# Altium schematic sheet RK3562-VCCIO2-VCCIO3.SchDoc
size 420 x 297 mm; SheetNumber: 8; SheetTotal: 32
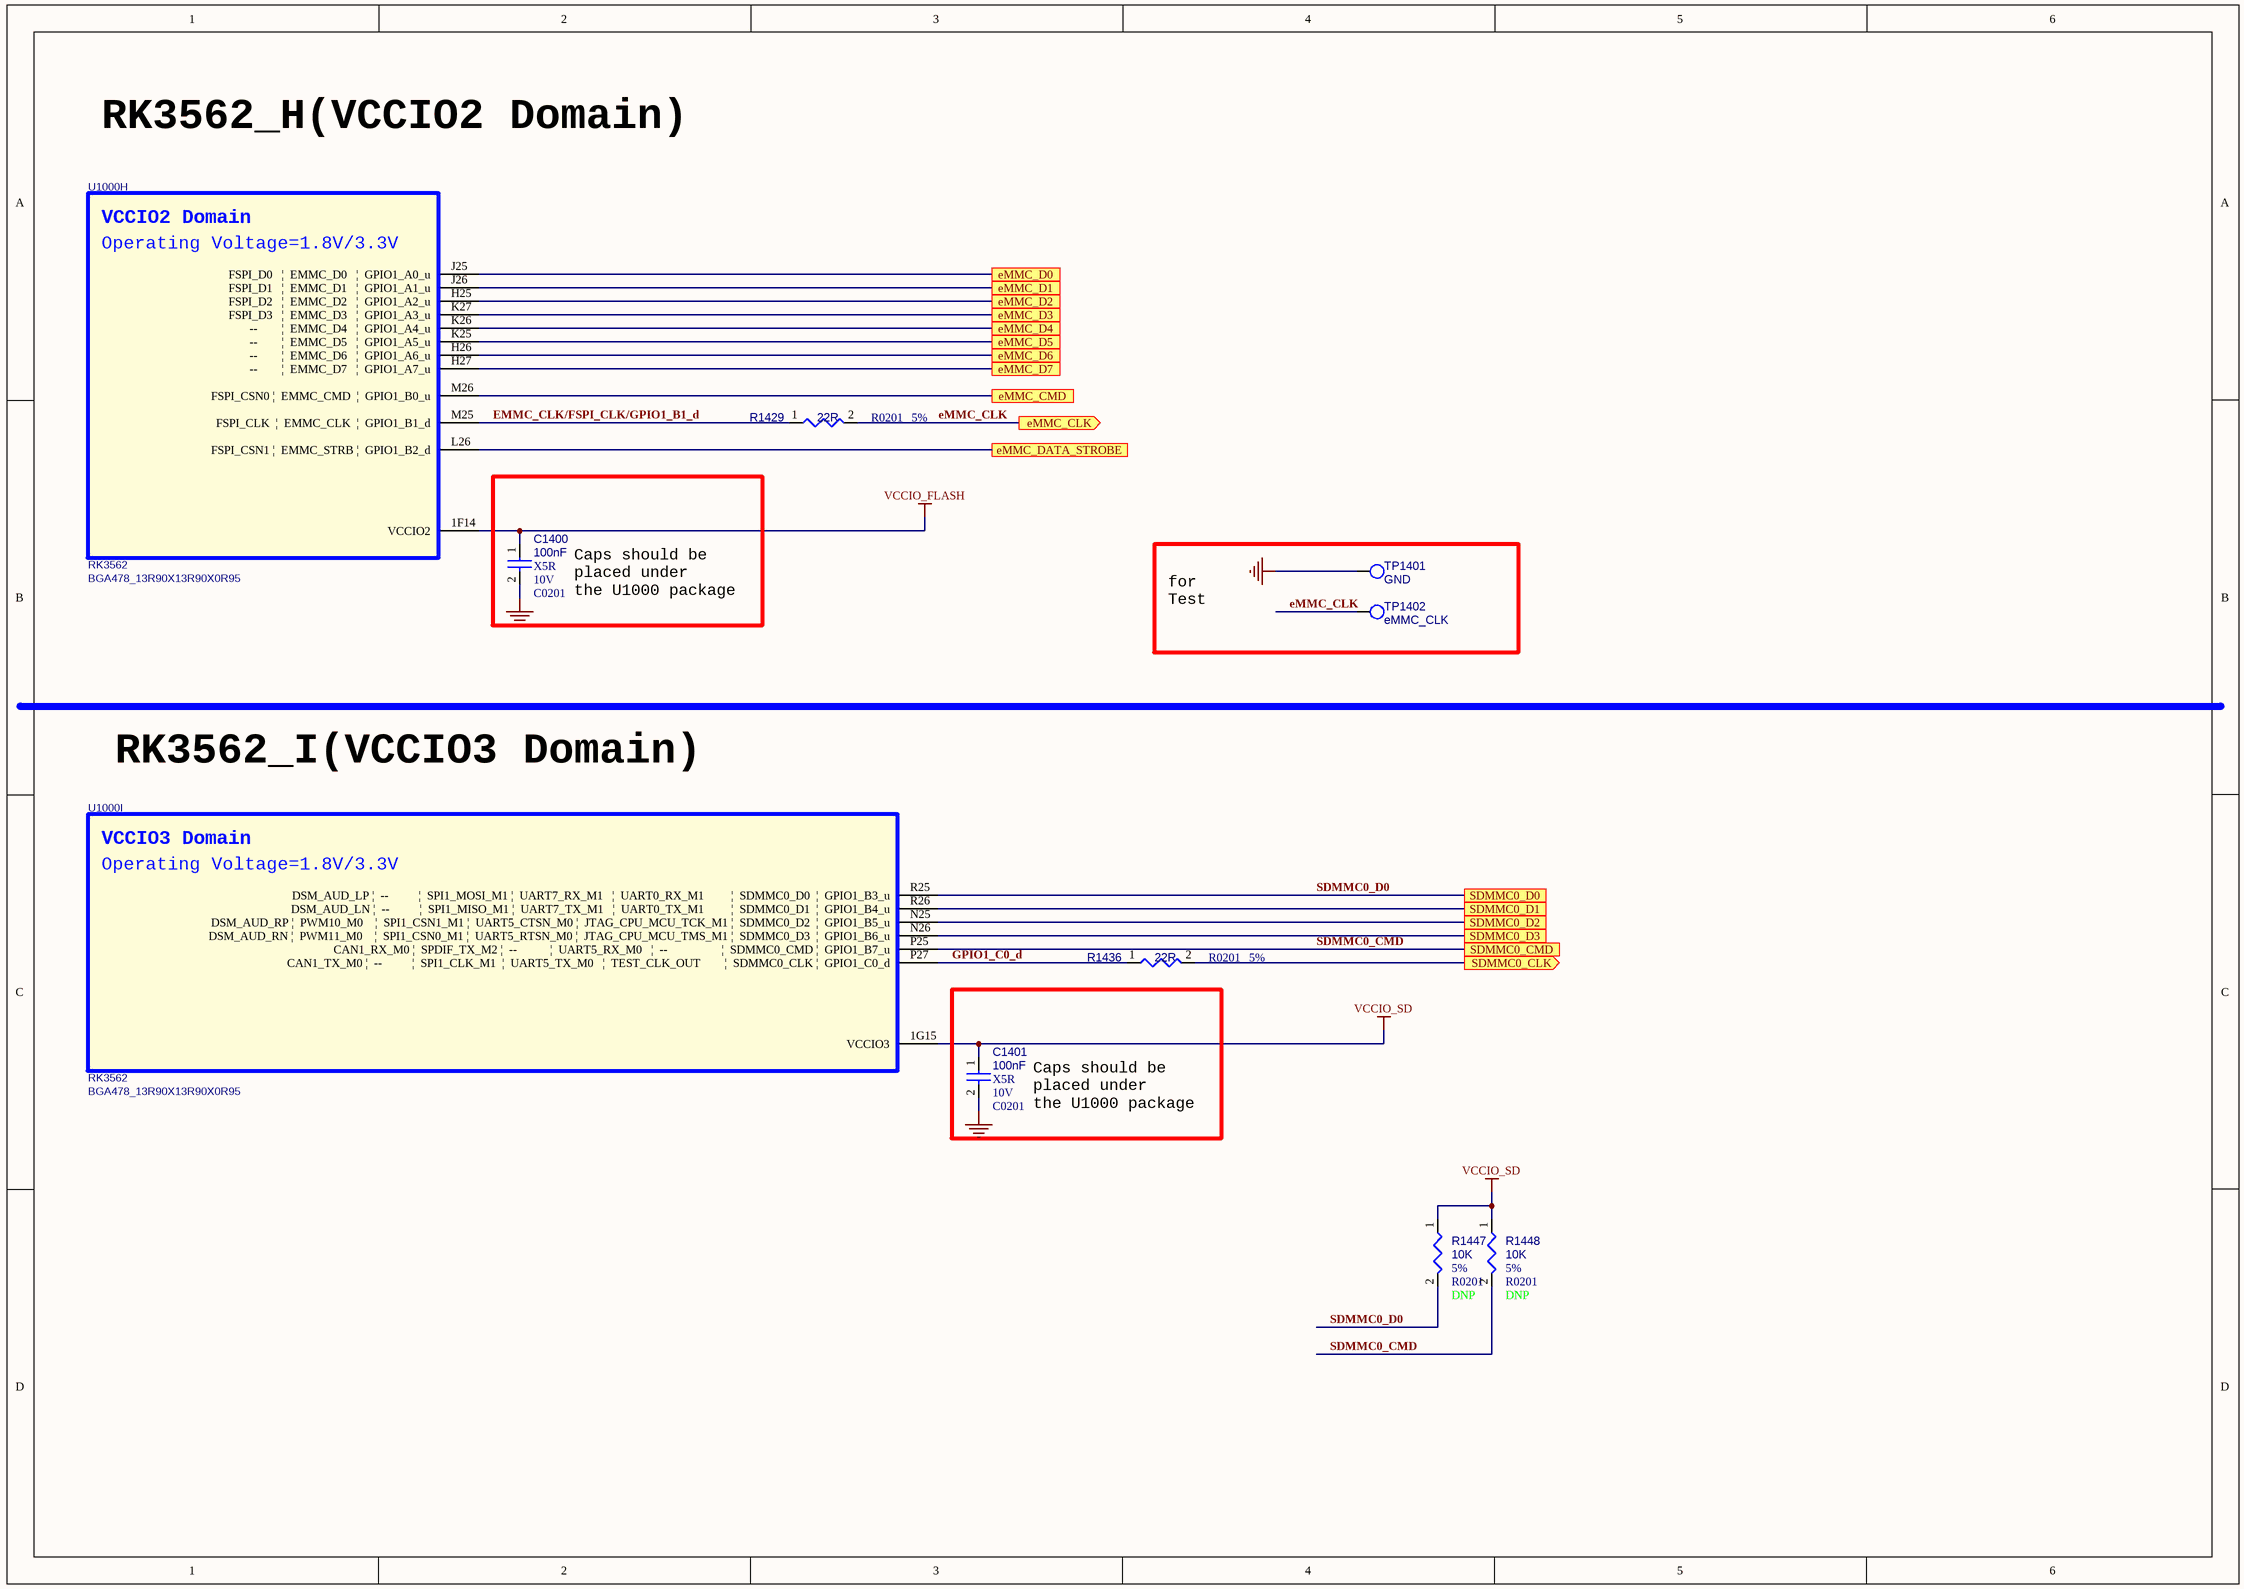
[diagram p0: RK3562-VCCIO2-VCCIO3.SchDoc]

## Parts
C1400  100nF  Dielectric: X5R  Voltage: 10V  [C0201]
C1401  100nF  Dielectric: X5R  Voltage: 10V  [C0201]
R1429  22R  Tolerance: 5%  [R0201]
R1436  22R  Tolerance: 5%  [R0201]
R1447  10K  Tolerance: 5%  option: DNP  [R0201]
R1448  10K  Tolerance: 5%  option: DNP  [R0201]
TP1401  GND  [TP_0R70]
TP1402  eMMC_CLK  [TP_0R70]
U1000  RK3562  [BGA478_13R90X13R90X0R95]  (parts H,I of 16)

## Ports
eMMC_CLK (out, see CONTROLLER-RK3562[4A], eMMC[2A]), eMMC_CMD (see CONTROLLER-RK3562[4A], eMMC[2A]), eMMC_D0 (see CONTROLLER-RK3562[4A], eMMC[2A]), eMMC_D1 (see CONTROLLER-RK3562[4A], eMMC[2A]), eMMC_D2 (see CONTROLLER-RK3562[4A], eMMC[2A]), eMMC_D3 (see CONTROLLER-RK3562[4A], eMMC[2A]), eMMC_D4 (see CONTROLLER-RK3562[4A], eMMC[2A]), eMMC_D5 (see CONTROLLER-RK3562[4A], eMMC[2A]), eMMC_D6 (see CONTROLLER-RK3562[4A], eMMC[2A]), eMMC_D7 (see CONTROLLER-RK3562[4A], eMMC[2A]), eMMC_DATA_STROBE (see CONTROLLER-RK3562[4A], eMMC[1B]), SDMMC0_CLK (out, see CONTROLLER-RK3562[4B], SD_TF-CARD[1A]), SDMMC0_CMD (see CONTROLLER-RK3562[4B], SD_TF-CARD[1A]), SDMMC0_D0 (see CONTROLLER-RK3562[4B], SD_TF-CARD[1A]), SDMMC0_D1 (see CONTROLLER-RK3562[4B], SD_TF-CARD[1A]), SDMMC0_D2 (see CONTROLLER-RK3562[4B], SD_TF-CARD[1A]), SDMMC0_D3 (see CONTROLLER-RK3562[4B], SD_TF-CARD[1A])

## Nets
GND: C1400.2 C1401.2 TP1401.1
VCCIO_FLASH: C1400.1 U1000.1F14(VCCIO2)
VCCIO_SD: C1401.1 R1447.1 R1448.1 U1000.1G15(VCCIO3)
eMMC_CLK: R1429.2 TP1402.1 ; port eMMC_CLK
EMMC_CLK/FSPI_CLK/GPIO1_B1_d: R1429.1 U1000.M25(FSPI_CLK__|__EMMC_CLK__|__GPIO1_B1_d)
eMMC_CMD: U1000.M26(FSPI_CSN0_|__EMMC_CMD__|__GPIO1_B0_u) ; port eMMC_CMD
eMMC_D0: U1000.J25(FSPI_D0___|__EMMC_D0___|__GPIO1_A0_u) ; port eMMC_D0
eMMC_D1: U1000.J26(FSPI_D1___|__EMMC_D1___|__GPIO1_A1_u) ; port eMMC_D1
eMMC_D2: U1000.H25(FSPI_D2___|__EMMC_D2___|__GPIO1_A2_u) ; port eMMC_D2
eMMC_D3: U1000.K27(FSPI_D3___|__EMMC_D3___|__GPIO1_A3_u) ; port eMMC_D3
eMMC_D4: U1000.K26(--________|__EMMC_D4___|__GPIO1_A4_u) ; port eMMC_D4
eMMC_D5: U1000.K25(--________|__EMMC_D5___|__GPIO1_A5_u) ; port eMMC_D5
eMMC_D6: U1000.H26(--________|__EMMC_D6___|__GPIO1_A6_u) ; port eMMC_D6
eMMC_D7: U1000.H27(--________|__EMMC_D7___|__GPIO1_A7_u) ; port eMMC_D7
eMMC_DATA_STROBE: U1000.L26(FSPI_CSN1_|__EMMC_STRB_|__GPIO1_B2_d) ; port eMMC_DATA_STROBE
GPIO1_C0_d: R1436.1 U1000.P27(CAN1_TX_M0_|__--__________|__SPI1_CLK_M1__|__UART5_TX_M0___|__TEST_CLK_OUT________|__SDMMC0_CLK_|__GPIO1_C0_d)
SDMMC0_CLK: R1436.2 ; port SDMMC0_CLK
SDMMC0_CMD: R1448.2 U1000.P25(CAN1_RX_M0_|__SPDIF_TX_M2_|__--___________|__UART5_RX_M0___|__--__________________|__SDMMC0_CMD_|__GPIO1_B7_u) ; port SDMMC0_CMD
SDMMC0_D0: R1447.2 U1000.R25(DSM_AUD_LP_|__--__________|__SPI1_MOSI_M1_|__UART7_RX_M1___|__UART0_RX_M1_________|__SDMMC0_D0__|__GPIO1_B3_u) ; port SDMMC0_D0
SDMMC0_D1: U1000.R26(DSM_AUD_LN_|__--__________|__SPI1_MISO_M1_|__UART7_TX_M1___|__UART0_TX_M1_________|__SDMMC0_D1__|__GPIO1_B4_u) ; port SDMMC0_D1
SDMMC0_D2: U1000.N25(DSM_AUD_RP_|__PWM10_M0____|__SPI1_CSN1_M1_|__UART5_CTSN_M0_|__JTAG_CPU_MCU_TCK_M1_|__SDMMC0_D2__|__GPIO1_B5_u) ; port SDMMC0_D2
SDMMC0_D3: U1000.N26(DSM_AUD_RN_|__PWM11_M0____|__SPI1_CSN0_M1_|__UART5_RTSN_M0_|__JTAG_CPU_MCU_TMS_M1_|__SDMMC0_D3__|__GPIO1_B6_u) ; port SDMMC0_D3

## Notes on the sheet
- RK3562_H(VCCIO2 Domain)
- Caps should be
  placed under
  the U1000 package
- for
  Test
- RK3562_I(VCCIO3 Domain)
- (in symbol SOC_RK3562, part H) VCCIO2 Domain; Operating Voltage=1.8V/3.3V
- (in symbol SOC_RK3562, part I) VCCIO3 Domain; Operating Voltage=1.8V/3.3V

## Library data of the parts
C1400 = CAP NP: cap,100.00nF,+/-10%,10V,X5R,C0201; Part Reference: C1400; Manufacturer PN: C0603X5R1A104K030BC; Manufacturer: TDK; Tolerance: 10%; Priority: A; PCB Footprint: C0201; Value: 100nF; Created by: JJJ; Part Type: C0201; RK PN: C0603X5R1A104K030BC; ClassName: RK
C1401 = CAP NP: cap,100.00nF,+/-10%,10V,X5R,C0201; Part Reference: C1401; Manufacturer: TDK; RK PN: C0603X5R1A104K030BC; Priority: A; Tolerance: 10%; PCB Footprint: C0201; Value: 100nF; Part Type: C0201; Manufacturer PN: C0603X5R1A104K030BC; Created by: JJJ; ClassName: RK
R1429 = RESISTOR: 通用厚膜电阻,22R,+/-5%,R0201,1/20W.; Part Reference: R1429; Manufacturer PN: RC0201JR-0722RL; Manufacturer: YAGEO; Wattage: 1/20W; Priority: A; RK PN: 901000523; PCB Footprint: R0201; Value: 22R; Created by: YTL; Part Type: 通用厚膜电阻; ClassName: RK
R1436 = RESISTOR: 通用厚膜电阻,22R,+/-5%,R0201,1/20W.; Part Reference: R1436; Manufacturer PN: RC0201JR-0722RL; Manufacturer: YAGEO; Wattage: 1/20W; Priority: A; RK PN: 901000523; PCB Footprint: R0201; Value: 22R; Created by: YTL; Part Type: 通用厚膜电阻; ClassName: RK
R1447 = RESISTOR: 通用厚膜电阻,10K,+/-5%,R0201,1/20W.; Part Reference: R1447; Manufacturer PN: RC0201JR-0710KL; Manufacturer: YAGEO; Wattage: 1/20W; Priority: A; RK PN: 901000476; PCB Footprint: R0201; Value: 10K; Created by: YTL; Part Type: 通用厚膜电阻; ClassName: RK
R1448 = RESISTOR: 通用厚膜电阻,10K,+/-5%,R0201,1/20W.; Part Reference: R1448; Manufacturer PN: RC0201JR-0710KL; Manufacturer: YAGEO; Wattage: 1/20W; Priority: A; RK PN: 901000476; PCB Footprint: R0201; Value: 10K; Created by: YTL; Part Type: 通用厚膜电阻; ClassName: RK
TP1401 = TP: Test Point 0.7mm; Part Reference: TP1401; RK PN: TESTPOINT_0R7; Priority: A; PCB Footprint: TP_0R70; Value: GND; Part Type: TP; Created by: JJJ; ClassName: RK
TP1402 = TP: Test Point 0.7mm; Part Reference: TP1402; Priority: A; RK PN: TESTPOINT_0R7; PCB Footprint: TP_0R70; Value: eMMC_CLK; Created by: JJJ; Part Type: TP; ClassName: RK
U1000 = SOC_RK3562: ROCKCHIP SOC; Part Reference: U1000; Manufacturer: Rockchip (瑞芯微); SPLIT_INST: TRUE; SWAP_INFO: (S1+S2+S3+S4+S5+S6+S7+S8+S9+S10+S11+S12+S13+S14+S15+S16); Priority: A; RK PN: 906000425; PCB Footprint: BGA478_13R90X13R90X0R95; Value: RK3562; Created by: JJJ; Manufacturer PN: RK3562; Part Type: SOC; ClassName: RK